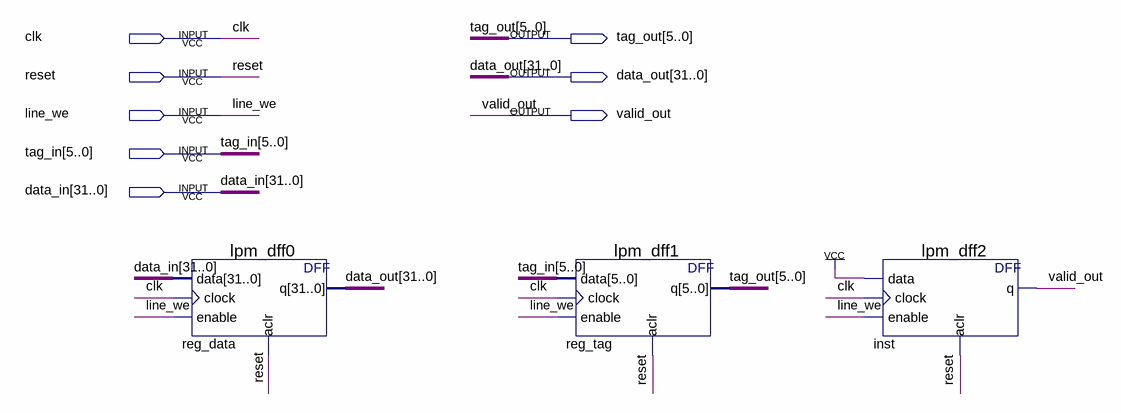
[diagram p0: schematic sheet]
// Quartus schematic cache_line.bdf as structural Verilog: 3 symbols, 8 pins
module cache_line (
  input  clk,
  input  reset,
  input  line_we,
  input  [5:0] tag_in,
  input  [31:0] data_in,
  output [5:0] tag_out,
  output [31:0] data_out,
  output valid_out
);

  lpm_dff0 reg_data (.data(data_in), .clock(clk), .enable(line_we), .aclr(reset), .q(data_out));
  lpm_dff1 reg_tag (.data(tag_in), .clock(clk), .enable(line_we), .aclr(reset), .q(tag_out));
  lpm_dff2 inst (.data(1'b1), .clock(clk), .enable(line_we), .aclr(reset), .q(valid_out));
endmodule
